# EAGLE schematic OTOduinoShield (EAGLE 5.11)
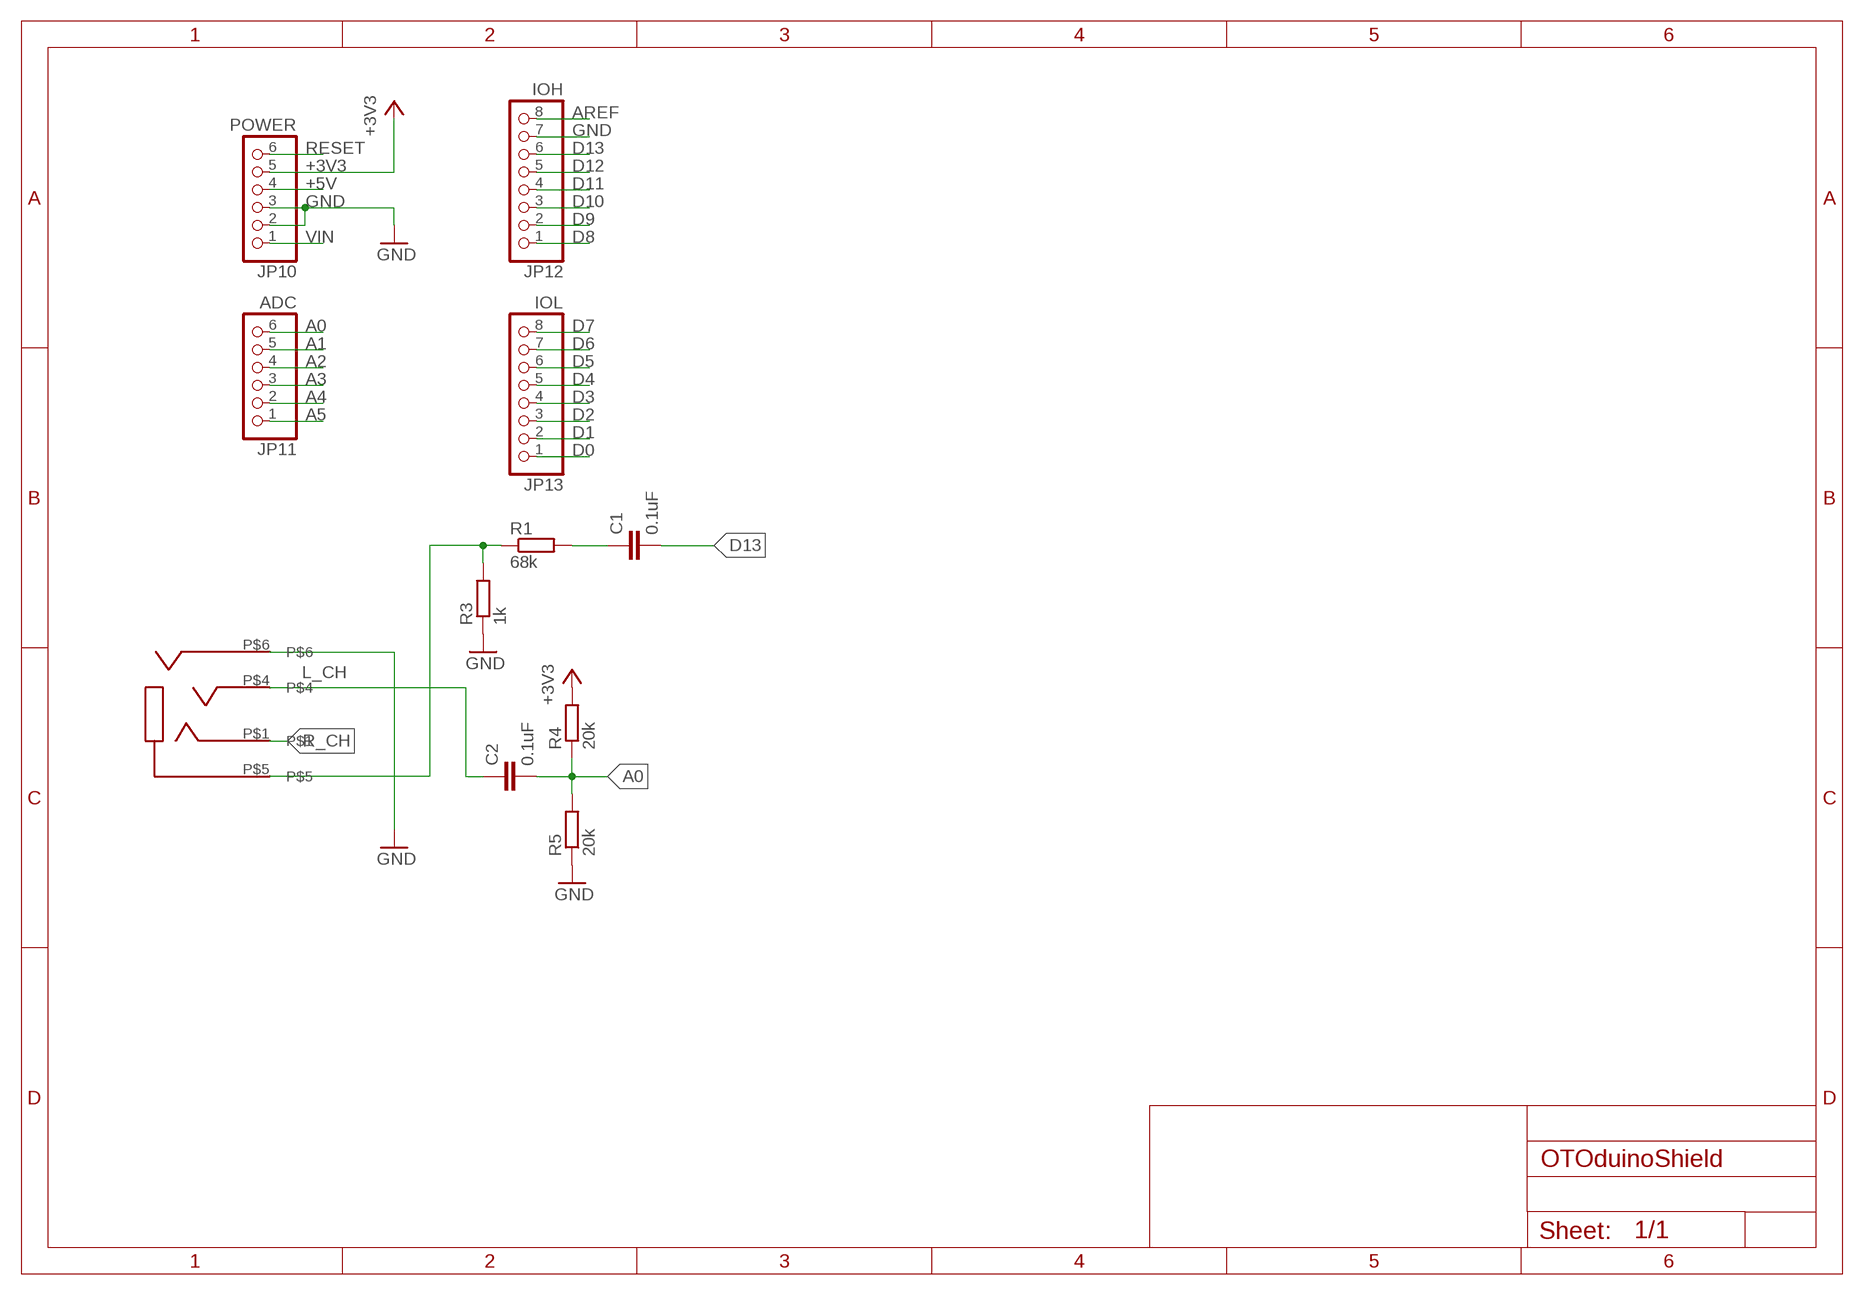
[diagram p0: schematic, sheet 1]

## Parts
C1  0.1uF  C-EU025-030X050  [C025-030X050]
C2  0.1uF  C-EU025-030X050  [C025-030X050]
JP10  POWER  PINHD-1X6  [1X06]
JP11  ADC  PINHD-1X6  [1X06]
JP12  IOH  PINHD-1X8  [1X08]
JP13  IOL  PINHD-1X8  [1X08]
R1  68k  R-EU_0207/10  [0207/10]
R3  1k  R-EU_0207/10  [0207/10]
R4  20k  R-EU_0207/10  [0207/10]
R5  20k  R-EU_0207/10  [0207/10]
U$3  SJ-43514  [SJ43514]

## Nets
+3V3: JP10.5 R4.2
+5V [power]: JP10.4
A0: C2.2 JP11.6 R4.1 R5.2
A1: JP11.5
A2: JP11.4
A3: JP11.3
A4: JP11.2
A5: JP11.1
AREF: JP12.8
D0: JP13.1
D1: JP13.2
D2: JP13.3
D3: JP13.4
D4: JP13.5
D5: JP13.6
D6: JP13.7
D7: JP13.8
D8: JP12.1
D9: JP12.2
D10: JP12.3
D11: JP12.4
D12: JP12.5
D13: C1.2 JP12.6
GND [power]: JP10.2 JP10.3 JP12.7 R3.1 R5.1 U$3.P$6
L_CH: C2.1 U$3.P$4
N$76: R1.1 R3.2 U$3.P$5
N$185: C1.1 R1.2
R_CH: U$3.P$1
RESET: JP10.6
VIN: JP10.1

## Library data of the parts
C1 C2 = resistor:C-EU: CAPACITOR, European symbol
JP10 JP11 = pinhead2:PINHD-1X6: PIN HEADER
JP12 JP13 = pinhead2:PINHD-1X8: PIN HEADER
R1 R3-R5 = resistor:R-EU_: RESISTOR, European symbol
U$3 = con-cui-audiojack:SJ-43514

## Net classes
1 power: width 0.254 mm